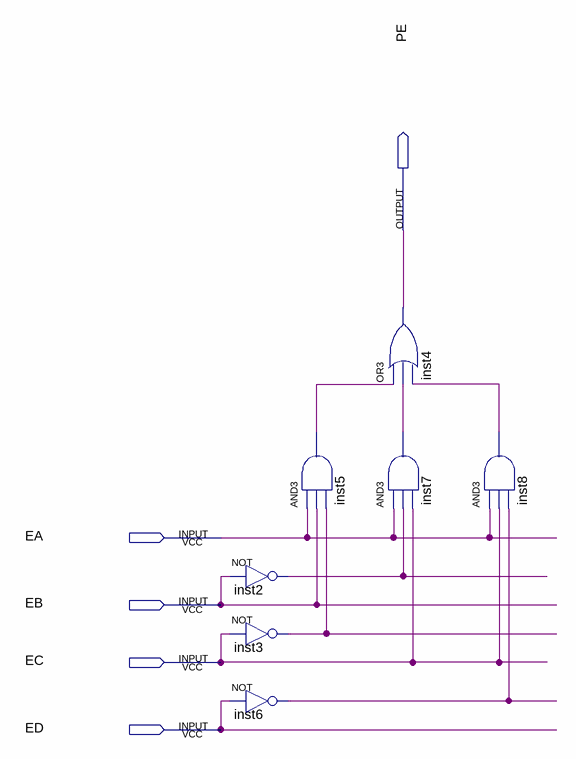
[diagram p0: schematic sheet]
// Quartus schematic ColunaE.bdf as structural Verilog: 7 symbols, 5 pins
module ColunaE (
  input  EA,
  input  EB,
  input  EC,
  input  ED,
  output PE
);

  wire inst2_out, inst3_out, inst5_out, inst6_out, inst7_out, inst8_out;

  not inst2 (inst2_out, EB);
  not inst3 (inst3_out, EC);
  not inst6 (inst6_out, ED);
  and inst5 (inst5_out, EA, EB, inst3_out);
  or inst4 (PE, inst5_out, inst7_out, inst8_out);
  and inst7 (inst7_out, EA, inst2_out, EC);
  and inst8 (inst8_out, EA, EC, inst6_out);
endmodule
